# Altium project PA-TDA74982.0.PrjPcb
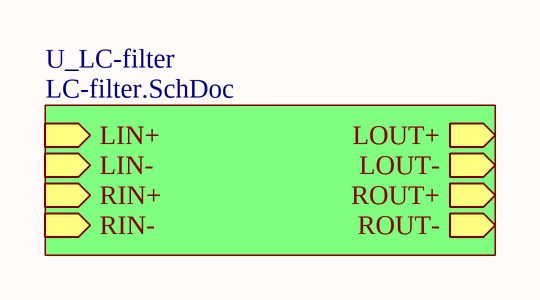
[diagram p0: PA-TDA74982.0.SchDoc]
2 sheets, 18 parts. Net scope: hierarchical (ports join the sheet entries above them; power ports are global).
Sheets:
  PA-TDA74982.0.SchDoc
    U_LC-filter = LC-filter.SchDoc

## Sheet PA-TDA74982.0.SchDoc
size A3

### Sub-sheets
U_LC-filter = LC-filter.SchDoc: LIN+ (in), LIN- (in), LOUT+ (out), LOUT- (out), RIN+ (in), RIN- (in), ROUT+ (out), ROUT- (out)

## Sheet LC-filter.SchDoc
size A3
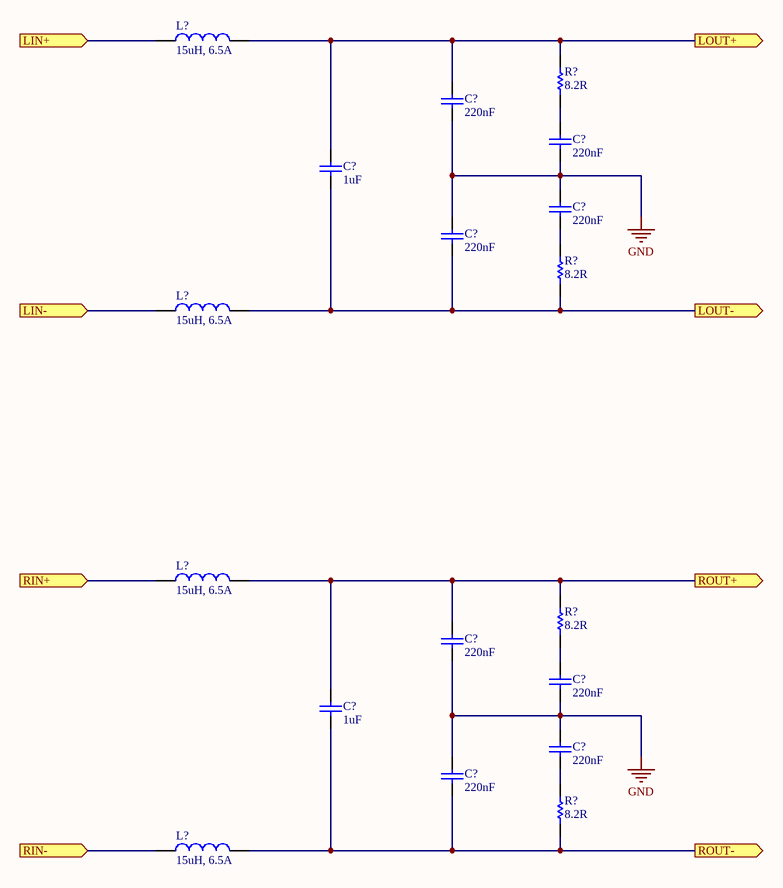
[diagram p1: LC-filter.SchDoc]

### Parts
(Parts that share a designator on the sheet are numbered #1, #2 ... from top to bottom, then left to right.)
C?#1  220nF  [CAP_RM5_W3.5L7.3H8]
C?#2  220nF  [CAP_RM5_W3.5L7.3H8]
C?#3  value 1uF  [CAP_RM5_W7.8L7.8H13-horizontal]  (hidden comment: 1uF/±5%/PET)
C?#4  220nF  [CAP_RM5_W3.5L7.3H8]
C?#5  220nF  [CAP_RM5_W3.5L7.3H8]
C?#6  220nF  [CAP_RM5_W3.5L7.3H8]
C?#7  220nF  [CAP_RM5_W3.5L7.3H8]
C?#8  value 1uF  [CAP_RM5_W7.8L7.8H13-horizontal]  (hidden comment: 1uF/±5%/PET)
C?#9  220nF  [CAP_RM5_W3.5L7.3H8]
C?#10  220nF  [CAP_RM5_W3.5L7.3H8]
L?#1  15uH, 6.5A  [WE-PD_1210]
L?#2  15uH, 6.5A  [WE-PD_1210]
L?#3  15uH, 6.5A  [WE-PD_1210]
L?#4  15uH, 6.5A  [WE-PD_1210]
R?#1  value 8.2R  [RESC1020]  (hidden comment: RES SMD 8.2 OHM 2W 2010 WIDE)
R?#2  value 8.2R  [RESC1020]  (hidden comment: RES SMD 8.2 OHM 2W 2010 WIDE)
R?#3  value 8.2R  [RESC1020]  (hidden comment: RES SMD 8.2 OHM 2W 2010 WIDE)
R?#4  value 8.2R  [RESC1020]  (hidden comment: RES SMD 8.2 OHM 2W 2010 WIDE)

### Ports
LIN+ (in), LIN- (in), LOUT+ (out), LOUT- (out), RIN+ (in), RIN- (in), ROUT+ (out), ROUT- (out)

### Nets
GND: C?#1.1 C?#2.1 C?#4.2 C?#5.2 C?#6.1 C?#7.1 C?#9.2 C?#10.2
NetC?#1_2: C?#1.2 C?#3.2 L?#1.2 R?#1.2 ; port LOUT+
NetC?#2_2: C?#2.2 R?#1.1
NetC?#3_1: C?#3.1 C?#5.1 L?#2.2 R?#2.1 ; port LOUT-
NetC?#4_1: C?#4.1 R?#2.2
NetC?#6_2: C?#6.2 C?#8.2 L?#3.2 R?#3.2 ; port ROUT+
NetC?#7_2: C?#7.2 R?#3.1
NetC?#8_1: C?#8.1 C?#10.1 L?#4.2 R?#4.1 ; port ROUT-
NetC?#9_1: C?#9.1 R?#4.2
NetL?#1_1: L?#1.1 ; port LIN+
NetL?#2_1: L?#2.1 ; port LIN-
NetL?#3_1: L?#3.1 ; port RIN+
NetL?#4_1: L?#4.1 ; port RIN-

### Library data of the parts
C?#1 C?#2 C?#4-C?#7 C?#9 C?#10 = CAP_B32529 _220nF: CAP FILM 0.22UF 5% 100VDC RADIAL; MPN: B32529C1224J289; Farnell: 2797826; DigiKey: 495-4875-3-ND; Tolerance: 5%; Value: 220nF
C?#3 C?#8 = CAP_B32529 _1uF: CAP FILM 1UF 5% 100VDC RADIAL; MPN: B32529D1105J289; Farnell: 2797848; DigiKey: 495-4875-3-ND; Tolerance: 5%
L?#1-L?#4 = 7447709150: WE-PD SMT Power Inductor, size 1210, 15uH, 6.5A; DC Resistance max.: 26mOhm; Self Resonant Frequency: 17MHz; Saturation Current: 8A; ComponentLink1Description: Manufacturer; ComponentLink1URL: http://www.we-online.de; ComponentLink2Description: Datasheet; ComponentLink2URL: https://katalog.we-online.com/pbs/datasheet/7447709150.pdf; Part Number: 7447709150; Published Date: April 2019; Publisher: Wurth Elektronik; Rated Current: 6.5A; Size: 1210; Inductance: 15uH; Operating Temperature: -40 to +125degC; Mounting Technology: SMT; Packaging: Tape and Reel
R?#1-R?#4 = RES_ERJ-B1BJ8R2U: 8.2 Ohms ±5% 2W Chip Resistor Wide 2010 (5025 Metric), 1020 Automotive AEC-Q200, Current Sense Thick Film; Tolerance: ±5%; DigiKey: ERJ-B1BJ8R2U-ND; Farnell: 2294027; Power: 2W; MPN: ERJ-B1BJ8R2U